# Altium schematic sheet STM32F407VG-A.SchDoc
size A4
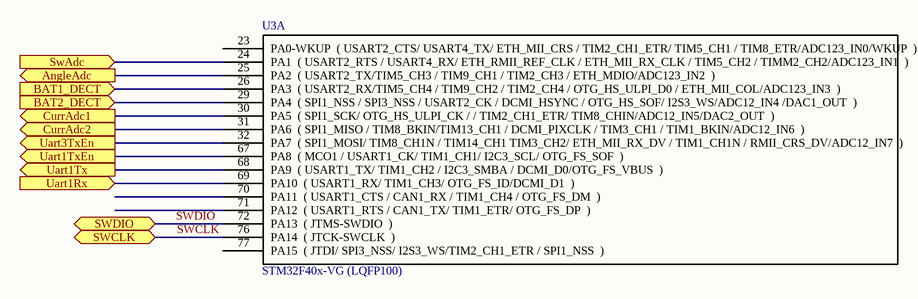
[diagram p0: STM32F407VG-A.SchDoc]

## Parts
U3  STM32F40x-VG (LQFP100)  [LQFP100_N]  (part A of 6)

## Ports
AngleAdc (out), BAT1_DECT (in), BAT2_DECT (in), CurrAdc1 (out), CurrAdc2 (out), SwAdc (in), SWCLK (bidir), SWDIO (bidir), Uart1Rx (in), Uart1Tx (out), Uart1TxEn (out), Uart3TxEn (out)

## Nets
AngleAdc: U3.25(PA2__(_USART2_TX/TIM5_CH3_/_TIM9_CH1_/_TIM2_CH3_/_ETH_MDIO/ADC123_IN2__)) ; port AngleAdc
BAT1_DECT: U3.26(PA3__(_USART2_RX/TIM5_CH4_/_TIM9_CH2_/_TIM2_CH4_/_OTG_HS_ULPI_D0_/_ETH_MII_COL/ADC123_IN3__)) ; port BAT1_DECT
BAT2_DECT: U3.29(PA4__(_SPI1_NSS_/_SPI3_NSS_/_USART2_CK_/_DCMI_HSYNC_/_OTG_HS_SOF/_I2S3_WS/ADC12_IN4_/DAC1_OUT__)) ; port BAT2_DECT
CurrAdc1: U3.30(PA5__(_SPI1_SCK/_OTG_HS_ULPI_CK_/_/_TIM2_CH1_ETR/_TIM8_CHIN/ADC12_IN5/DAC2_OUT__)) ; port CurrAdc1
CurrAdc2: U3.31(PA6__(_SPI1_MISO_/_TIM8_BKIN/TIM13_CH1_/_DCMI_PIXCLK_/_TIM3_CH1_/_TIM1_BKIN/ADC12_IN6__)) ; port CurrAdc2
SwAdc: U3.24(PA1__(_USART2_RTS_/_USART4_RX/_ETH_RMII_REF_CLK_/_ETH_MII_RX_CLK_/_TIM5_CH2_/_TIMM2_CH2/ADC123_IN1__)) ; port SwAdc
SWCLK: U3.76(PA14__(_JTCK-SWCLK__)) ; port SWCLK
SWDIO: U3.72(PA13__(_JTMS-SWDIO__)) ; port SWDIO
Uart1Rx: U3.69(PA10__(_USART1_RX/_TIM1_CH3/_OTG_FS_ID/DCMI_D1__)) ; port Uart1Rx
Uart1Tx: U3.68(PA9__(_USART1_TX/_TIM1_CH2_/_I2C3_SMBA_/_DCMI_D0/OTG_FS_VBUS__)) ; port Uart1Tx
Uart1TxEn: U3.67(PA8__(_MCO1_/_USART1_CK/_TIM1_CH1/_I2C3_SCL/_OTG_FS_SOF__)) ; port Uart1TxEn
Uart3TxEn: U3.32(PA7__(_SPI1_MOSI/_TIM8_CH1N_/_TIM14_CH1_TIM3_CH2/_ETH_MII_RX_DV_/_TIM1_CH1N_/_RMII_CRS_DV/ADC12_IN7__)) ; port Uart3TxEn

Not connected (* = marked no-connect by the designer): U3 23(PA0-WKUP__(_USART2_CTS/_USART4_TX/_ETH_MII_CRS_/_TIM2_CH1_ETR/_TIM5_CH1_/_TIM8_ETR/ADC123_IN0/WKUP__)) 70(PA11__(_USART1_CTS_/_CAN1_RX_/_TIM1_CH4_/_OTG_FS_DM__)) 71(PA12__(_USART1_RTS_/_CAN1_TX/_TIM1_ETR/_OTG_FS_DP__)) 77(PA15__(_JTDI/_SPI3_NSS/_I2S3_WS/TIM2_CH1_ETR_/_SPI1_NSS__))

## Library data of the parts
U3 = STM32F40x-VG